# EAGLE schematic nawilzacz (EAGLE 7.6.0)
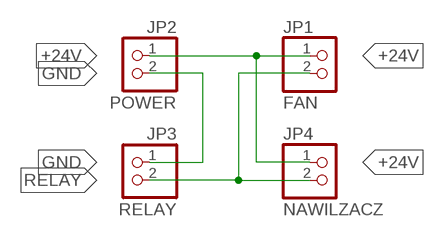
[diagram p0: schematic, sheet 1]

## Parts
JP1  FAN  PINHD-1X2  [1X02]
JP2  POWER  PINHD-1X2  [1X02]
JP3  RELAY  PINHD-1X2  [1X02]
JP4  NAWILZACZ  PINHD-1X2  [1X02]

## Nets
+24V: JP1.1 JP2.1 JP4.1
GND: JP2.2 JP3.1
RELAY: JP1.2 JP3.2 JP4.2

## Library data of the parts
JP1-JP4 = pinhead:PINHD-1X2: PIN HEADER